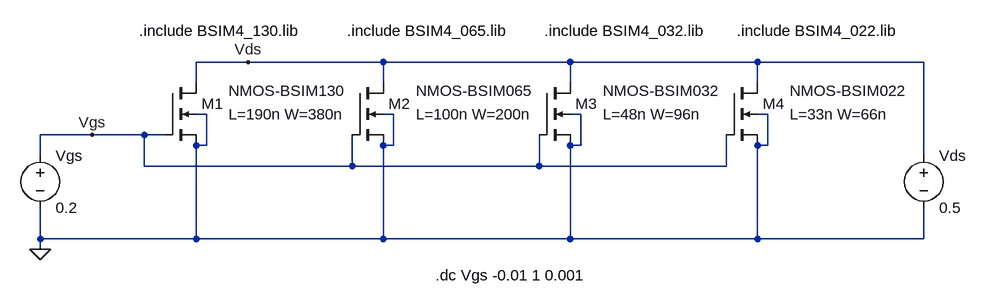
[diagram p0: schematic gm-id.asc]
gm-id.asc, the LTspice schematic file:
Version 4
SHEET 1 1532 756
WIRE 256 112 176 112
WIRE 464 112 256 112
WIRE 752 112 464 112
WIRE 1040 112 752 112
WIRE 1296 112 1040 112
WIRE 176 144 176 112
WIRE 464 144 464 112
WIRE 752 144 752 112
WIRE 1040 144 1040 112
WIRE 192 192 176 192
WIRE 480 192 464 192
WIRE 768 192 752 192
WIRE 1056 192 1040 192
WIRE 16 224 -64 224
WIRE 96 224 16 224
WIRE 128 224 96 224
WIRE 192 240 192 192
WIRE 192 240 176 240
WIRE 480 240 480 192
WIRE 480 240 464 240
WIRE 768 240 768 192
WIRE 768 240 752 240
WIRE 1056 240 1056 192
WIRE 1056 240 1040 240
WIRE -64 256 -64 224
WIRE 1296 256 1296 112
WIRE 96 272 96 224
WIRE 416 272 416 224
WIRE 416 272 96 272
WIRE 704 272 704 224
WIRE 704 272 416 272
WIRE 992 272 992 224
WIRE 992 272 704 272
WIRE -64 384 -64 336
WIRE 176 384 176 240
WIRE 176 384 -64 384
WIRE 464 384 464 240
WIRE 464 384 176 384
WIRE 752 384 752 240
WIRE 752 384 464 384
WIRE 1040 384 1040 240
WIRE 1040 384 752 384
WIRE 1296 384 1296 336
WIRE 1296 384 1040 384
WIRE -64 400 -64 384
FLAG -64 400 0
FLAG 16 224 Vgs
FLAG 256 112 Vds
SYMBOL nmos4 128 144 R0
WINDOW 123 98 48 Left 2
WINDOW 3 98 12 Left 2
SYMATTR Value2 L=190n W=380n
SYMATTR Value NMOS-BSIM130
SYMATTR InstName M1
SYMBOL voltage -64 240 R0
SYMATTR InstName Vgs
SYMATTR Value 0.2
SYMBOL voltage 1296 240 R0
SYMATTR InstName Vds
SYMATTR Value 0.5
SYMBOL nmos4 416 144 R0
WINDOW 123 98 48 Left 2
WINDOW 3 98 12 Left 2
SYMATTR Value2 L=100n W=200n
SYMATTR Value NMOS-BSIM065
SYMATTR InstName M2
SYMBOL nmos4 704 144 R0
WINDOW 123 98 48 Left 2
WINDOW 3 98 12 Left 2
SYMATTR Value2 L=48n W=96n
SYMATTR Value NMOS-BSIM032
SYMATTR InstName M3
SYMBOL nmos4 992 144 R0
WINDOW 123 98 48 Left 2
WINDOW 3 98 12 Left 2
SYMATTR Value2 L=33n W=66n
SYMATTR Value NMOS-BSIM022
SYMATTR InstName M4
TEXT 88 64 Left 2 !.include BSIM4_130.lib
TEXT 544 440 Left 2 !.dc Vgs -0.01 1 0.001
TEXT 408 64 Left 2 !.include BSIM4_065.lib
TEXT 712 64 Left 2 !.include BSIM4_032.lib
TEXT 1008 64 Left 2 !.include BSIM4_022.lib

The netlist it stands for:
* gm-id.asc
M1 Vds Vgs 0 0 NMOS-BSIM130 L=190n W=380n
Vgs Vgs 0 0.2
Vds Vds 0 0.5
M2 Vds Vgs 0 0 NMOS-BSIM065 L=100n W=200n
M3 Vds Vgs 0 0 NMOS-BSIM032 L=48n W=96n
M4 Vds Vgs 0 0 NMOS-BSIM022 L=33n W=66n
.model NMOS NMOS
.model PMOS PMOS
.lib standard.mos
.include BSIM4_130.lib
.dc Vgs -0.01 1 0.001
.include BSIM4_065.lib
.include BSIM4_032.lib
.include BSIM4_022.lib
.backanno
.end